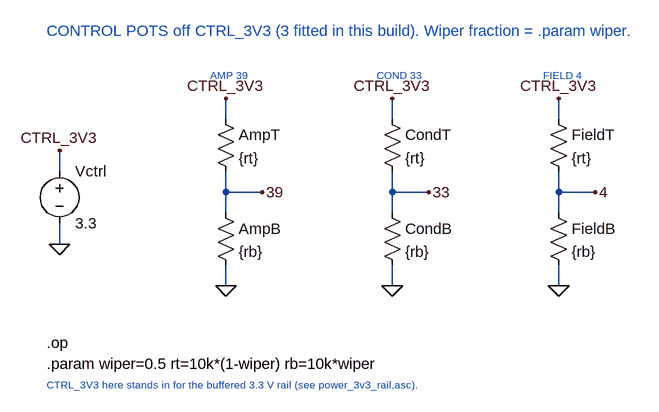
[diagram p0: schematic pots.asc]
pots.asc, the LTspice schematic file:
Version 4
SHEET 1 1100 760
WIRE -240 -16 -240 16
WIRE -240 96 -240 128
WIRE 16 -96 16 -64
WIRE 16 16 16 80
WIRE 16 48 72 48
WIRE 16 160 16 192
WIRE 272 -96 272 -64
WIRE 272 16 272 80
WIRE 272 48 328 48
WIRE 272 160 272 192
WIRE 528 -96 528 -64
WIRE 528 16 528 80
WIRE 528 48 584 48
WIRE 528 160 528 192
FLAG -240 -16 CTRL_3V3
FLAG -240 128 0
FLAG 16 -96 CTRL_3V3
FLAG 72 48 39
FLAG 16 192 0
FLAG 272 -96 CTRL_3V3
FLAG 328 48 33
FLAG 272 192 0
FLAG 528 -96 CTRL_3V3
FLAG 584 48 4
FLAG 528 192 0
SYMBOL voltage -240 0 R0
WINDOW 123 0 0 Left 0
WINDOW 39 0 0 Left 0
SYMATTR InstName Vctrl
SYMATTR Value 3.3
SYMBOL res 0 -80 R0
SYMATTR InstName AmpT
SYMATTR Value {rt}
SYMBOL res 0 64 R0
SYMATTR InstName AmpB
SYMATTR Value {rb}
SYMBOL res 256 -80 R0
SYMATTR InstName CondT
SYMATTR Value {rt}
SYMBOL res 256 64 R0
SYMATTR InstName CondB
SYMATTR Value {rb}
SYMBOL res 512 -80 R0
SYMATTR InstName FieldT
SYMATTR Value {rt}
SYMBOL res 512 64 R0
SYMATTR InstName FieldB
SYMATTR Value {rb}
TEXT -8 -132 Left 1 ;AMP 39
TEXT 248 -132 Left 1 ;COND 33
TEXT 504 -132 Left 1 ;FIELD 4
TEXT -260 -200 Left 2 ;CONTROL POTS off CTRL_3V3 (3 fitted in this build). Wiper fraction = .param wiper.
TEXT -260 280 Left 2 !.op
TEXT -260 312 Left 2 !.param wiper=0.5 rt=10k*(1-wiper) rb=10k*wiper
TEXT -260 344 Left 1 ;CTRL_3V3 here stands in for the buffered 3.3 V rail (see power_3v3_rail.asc).

The netlist it stands for:
* pots.asc
Vctrl CTRL_3V3 0 3.3
R§AmpT CTRL_3V3 39 {rt}
R§AmpB 39 0 {rb}
R§CondT CTRL_3V3 33 {rt}
R§CondB 33 0 {rb}
R§FieldT CTRL_3V3 4 {rt}
R§FieldB 4 0 {rb}
* AMP 39
* COND 33
* FIELD 4
* CONTROL POTS off CTRL_3V3 (3 fitted in this build). Wiper fraction = .param wiper.
.op
.param wiper=0.5 rt=10k*(1-wiper) rb=10k*wiper
* CTRL_3V3 here stands in for the buffered 3.3 V rail (see power_3v3_rail.asc).
.backanno
.end